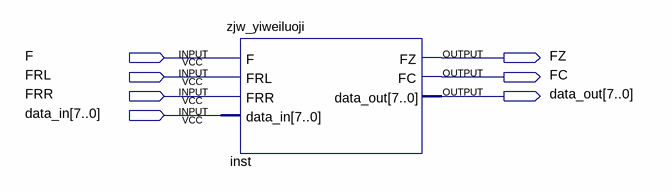
[diagram p0: schematic sheet]
// Quartus schematic Block1.bdf as structural Verilog: 1 symbols, 7 pins
module Block1 (
  input  F,
  input  FRL,
  input  FRR,
  input  [7:0] data_in,
  output FZ,
  output FC,
  output [7:0] data_out
);

  zjw_yiweiluoji inst (.F(F), .FRL(FRL), .FRR(FRR), .data_in(data_in), .FZ(FZ), .FC(FC), .data_out(data_out));
endmodule
